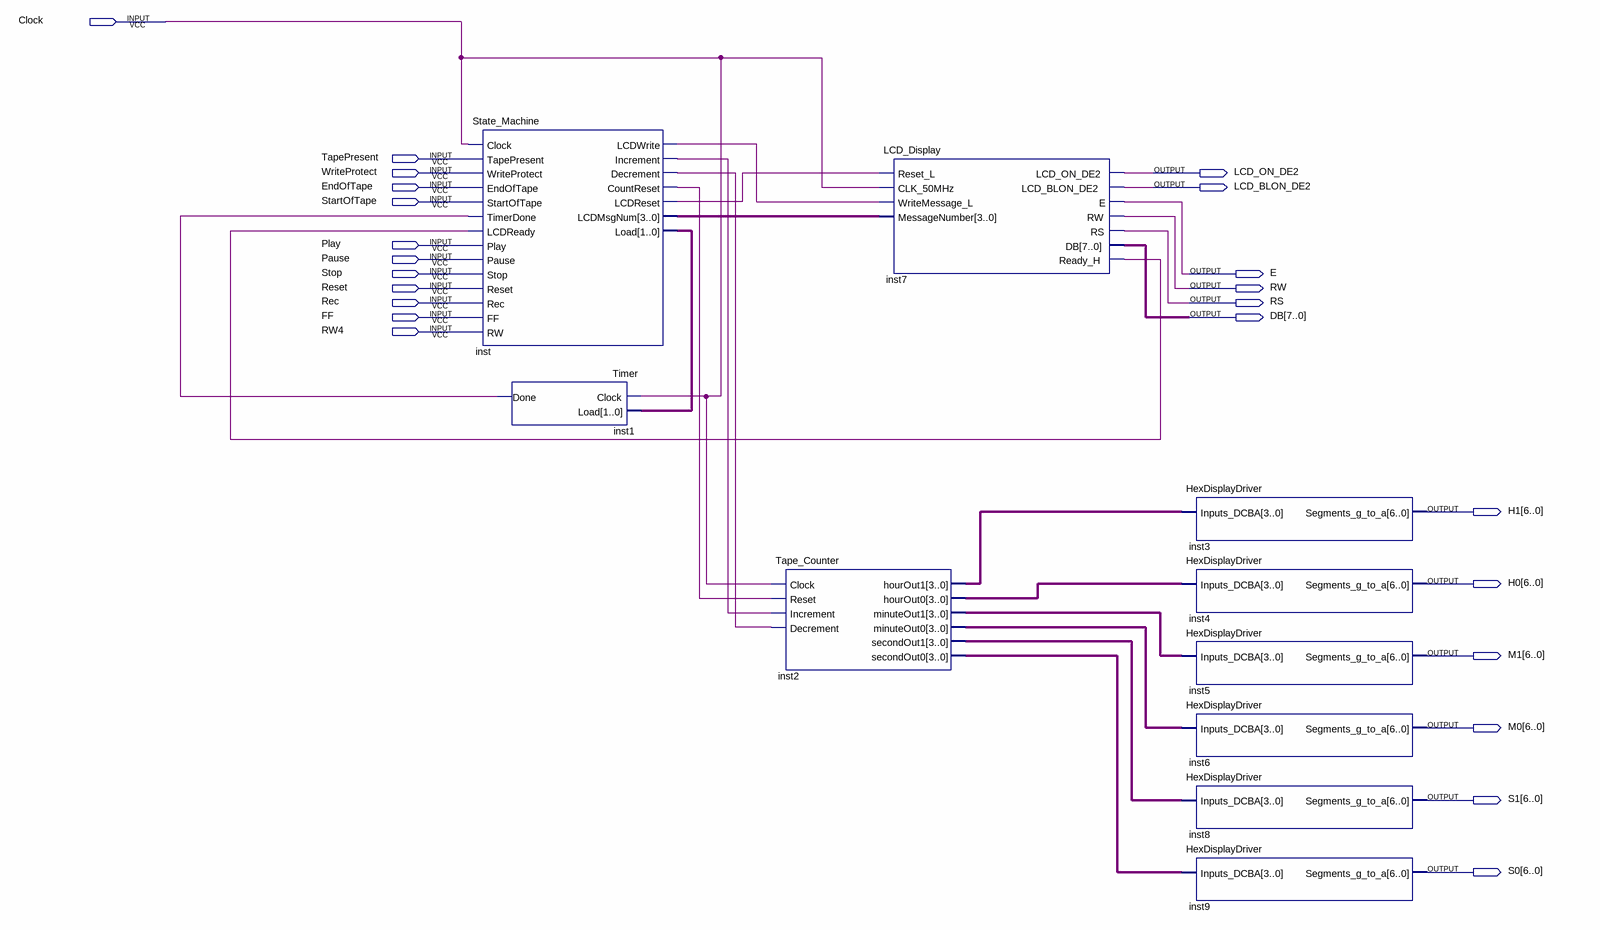
[diagram p0: schematic sheet]
// Quartus schematic VCR.bdf as structural Verilog: 10 symbols, 24 pins
module VCR (
  input  Clock,
  input  TapePresent,
  input  WriteProtect,
  input  EndOfTape,
  input  StartOfTape,
  input  Play,
  input  Pause,
  input  Stop,
  input  Reset,
  input  Rec,
  input  FF,
  input  RW4,
  output LCD_ON_DE2,
  output LCD_BLON_DE2,
  output E,
  output RW,
  output RS,
  output [7:0] DB,
  output [6:0] H1,
  output [6:0] H0,
  output [6:0] M1,
  output [6:0] M0,
  output [6:0] S1,
  output [6:0] S0
);

  wire inst1_done, inst7_ready_h, inst_countreset, inst_decrement, inst_increment, inst_lcdreset,
       inst_lcdwrite;
  wire [1:0] inst_load;
  wire [3:0] inst2_hourout0, inst2_hourout1, inst2_minuteout0, inst2_minuteout1, inst2_secondout0,
       inst2_secondout1, inst_lcdmsgnum;

  State_Machine inst (
    .Clock(Clock), .TapePresent(TapePresent), .WriteProtect(WriteProtect), .EndOfTape(EndOfTape),
    .StartOfTape(StartOfTape), .TimerDone(inst1_done), .LCDReady(inst7_ready_h), .Play(Play), .Pause(Pause),
    .Stop(Stop), .Reset(Reset), .Rec(Rec), .FF(FF), .RW(RW4), .LCDWrite(inst_lcdwrite),
    .Increment(inst_increment), .Decrement(inst_decrement), .CountReset(inst_countreset),
    .LCDReset(inst_lcdreset), .LCDMsgNum(inst_lcdmsgnum), .Load(inst_load));
  Timer inst1 (.Clock(Clock), .Load(inst_load), .Done(inst1_done));
  Tape_Counter inst2 (
    .Clock(Clock), .Reset(inst_countreset), .Increment(inst_increment), .Decrement(inst_decrement),
    .hourOut1(inst2_hourout1), .hourOut0(inst2_hourout0), .minuteOut1(inst2_minuteout1),
    .minuteOut0(inst2_minuteout0), .secondOut1(inst2_secondout1), .secondOut0(inst2_secondout0));
  LCD_Display inst7 (
    .Reset_L(inst_lcdreset), .CLK_50MHz(Clock), .WriteMessage_L(inst_lcdwrite),
    .MessageNumber(inst_lcdmsgnum), .LCD_ON_DE2(LCD_ON_DE2), .LCD_BLON_DE2(LCD_BLON_DE2), .E(E), .RW(RW),
    .RS(RS), .DB(DB), .Ready_H(inst7_ready_h));
  HexDisplayDriver inst3 (.Inputs_DCBA(inst2_hourout1), .Segments_g_to_a(H1));
  HexDisplayDriver inst4 (.Inputs_DCBA(inst2_hourout0), .Segments_g_to_a(H0));
  HexDisplayDriver inst5 (.Inputs_DCBA(inst2_minuteout1), .Segments_g_to_a(M1));
  HexDisplayDriver inst6 (.Inputs_DCBA(inst2_minuteout0), .Segments_g_to_a(M0));
  HexDisplayDriver inst8 (.Inputs_DCBA(inst2_secondout1), .Segments_g_to_a(S1));
  HexDisplayDriver inst9 (.Inputs_DCBA(inst2_secondout0), .Segments_g_to_a(S0));
endmodule
